# Altium schematic sheet relay.SchDoc
size A
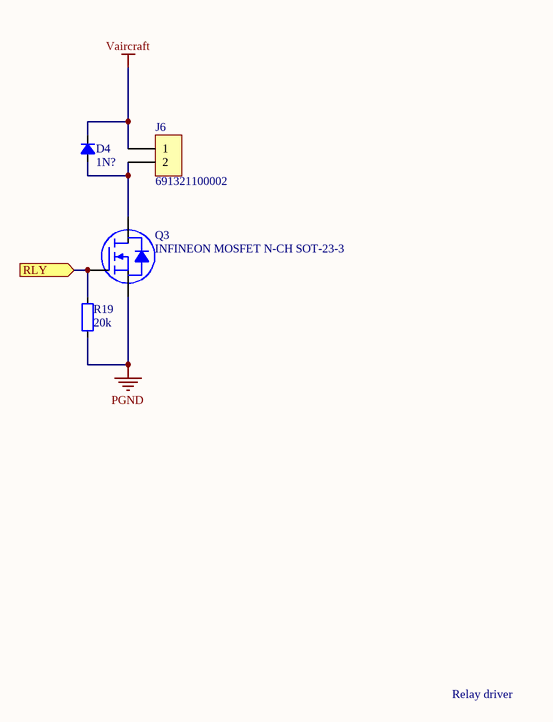
[diagram p0: relay.SchDoc]

## Parts
D4  value 1N?  [SOD123F]  (hidden comment: Diode_SOD523)
J6  691321100002  [691322110002]
Q3  INFINEON MOSFET N-CH SOT-23-3  [INFINEON SOT-23-3]
R19  value 20k  [RES_0603]  (hidden comment: Res_0603)

## Ports
RLY (in)

## Nets
PGND: Q3.3(S) R19.1
Vaircraft: D4.2(K) J6.1
RLY: Q3.1(G) R19.2 ; port RLY
NetD4_1: D4.1(A) J6.2 Q3.2(D)

## Notes on the sheet
- Relay driver

## Library data of the parts
D4 = Diode_SOD523: Diode
J6 = 691321100002: WR-TBL Terminal block - serie 3211 - 3.50 mm; Manufacturer: Würth Elektronik eiSos GmbH; ComponentLink1 Description: Manufacturer; ComponentLink2 Description: Datasheet; NoPins: 2; Created Date: 9 December 2013; partNo: 691321100002; ComponentLink1URL: http://www.we-online.com; ComponentLink2URL: http://katalog.we-online.de/em/datasheet/6913211000xx.pdf; Created by: Karrer Zheng
R19 = Res_0603: Resistor